# EAGLE design design-v1_1 (EAGLE 7.3.0)

## Sheet 1 of 3: Energy harvester
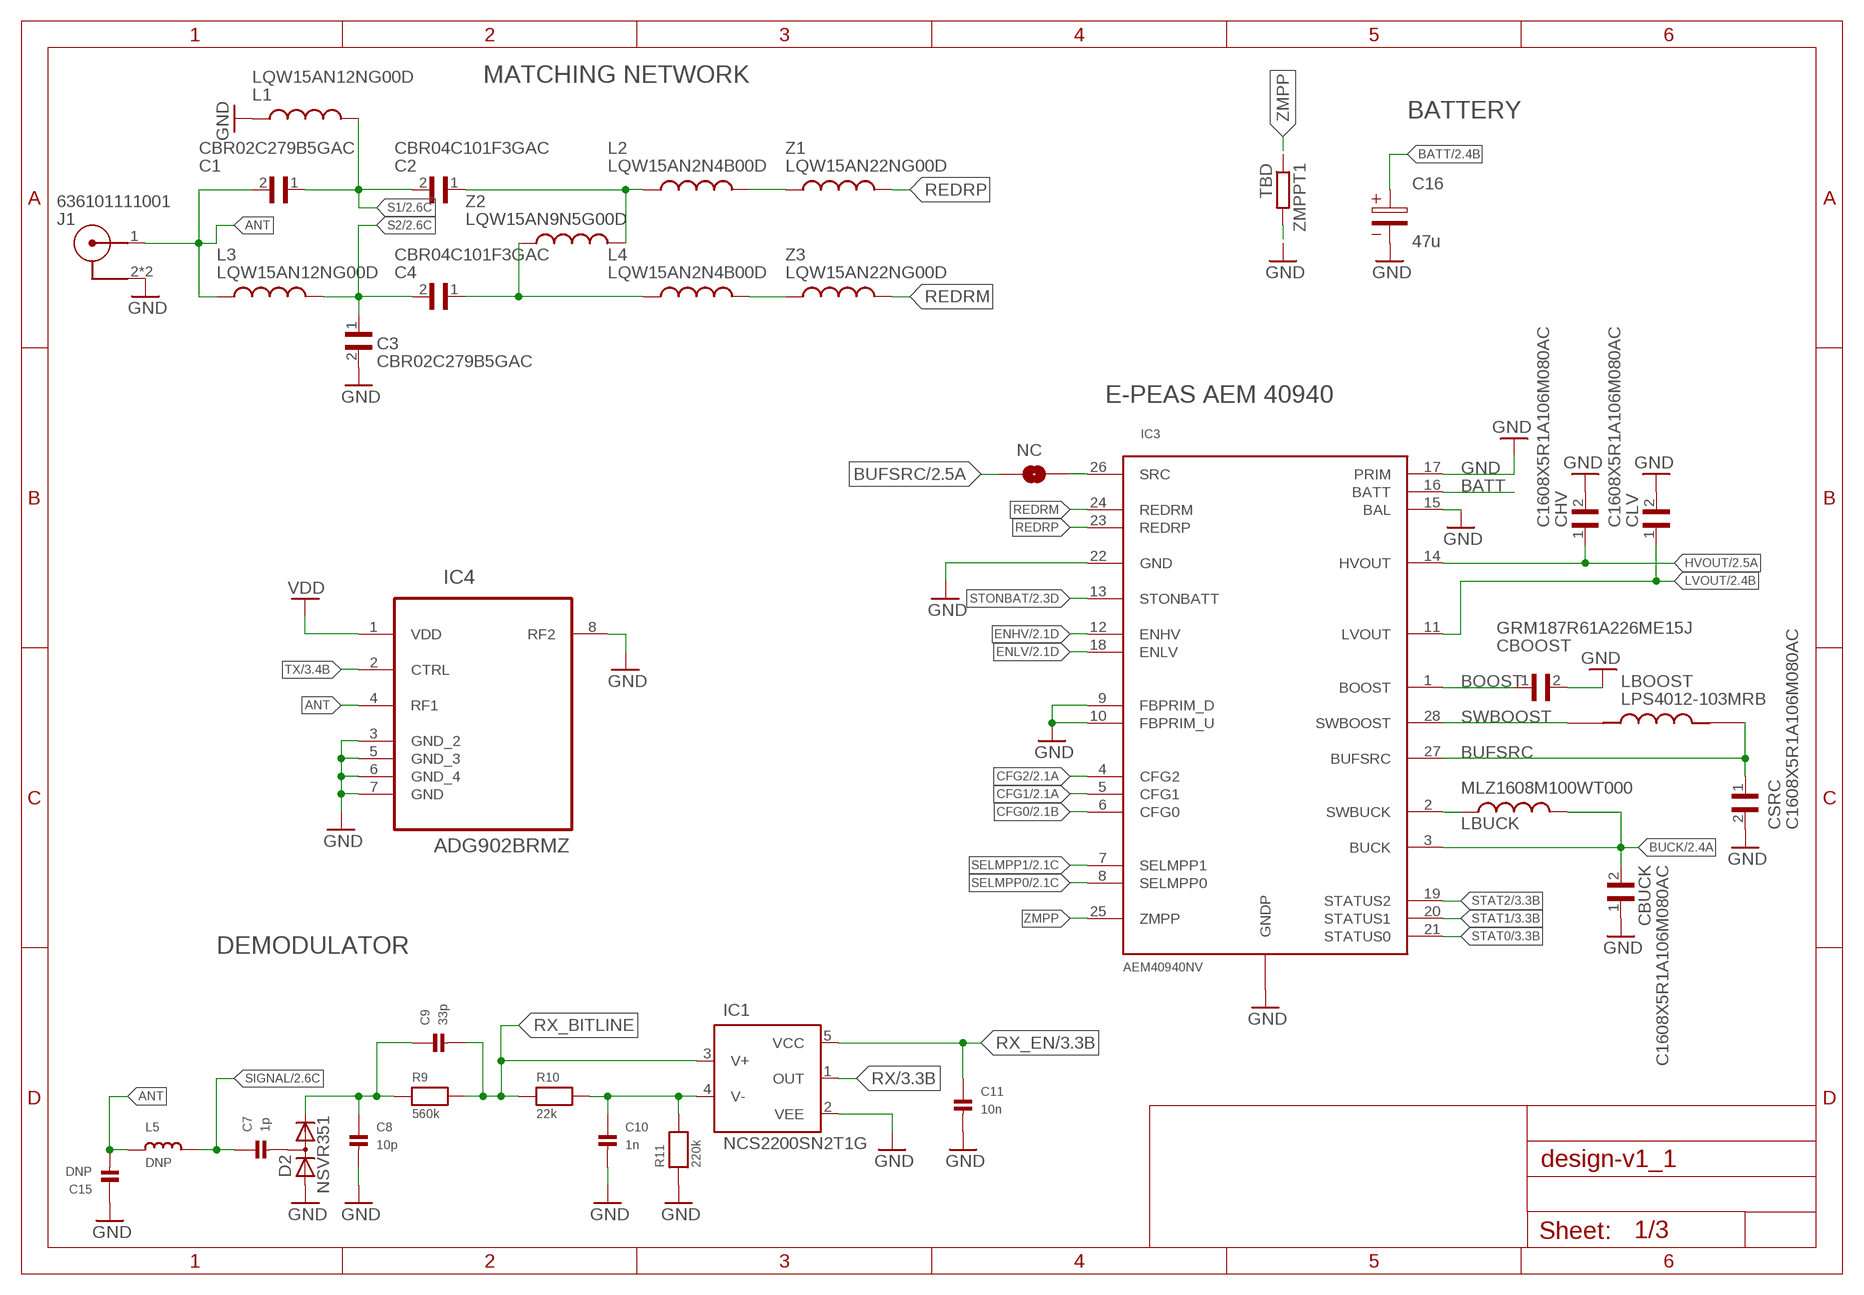
[diagram p0: schematic, sheet 1]

### Parts
C1  CBR02C279B5GAC  CBR04C101F3GAC  [CAPC1005X55N]
C2  CBR04C101F3GAC  [CAPC1005X55N]
C3  CBR02C279B5GAC  CBR04C101F3GAC  [CAPC1005X55N]
C4  CBR04C101F3GAC  [CAPC1005X55N]
C7  1p  CAP_CERAMIC0402  [0402]
C8  10p  CAP_CERAMIC0402  [0402]
C9  33p  CAP_CERAMIC0402  [0402]
C10  1n  CAP_CERAMIC0402  [0402]
C11  10n  CAP_CERAMIC0402  [0402]
C15  DNP  CAP_CERAMIC0402  [0402]
C16  47u  WCAP-ASLI_5X5,5_865080242004  [3X1.6X1.4(BXCXA)]
CBOOST  GRM187R61A226ME15J  [CAPC1608X80N]
CBUCK  C1608X5R1A106M080AC  [CAPC1608X90N]
CHV  C1608X5R1A106M080AC  [CAPC1608X90N]
CLV  C1608X5R1A106M080AC  [CAPC1608X90N]
CSRC  C1608X5R1A106M080AC  [CAPC1608X90N]
D2  NSVR351  DIODE_2CACA-SOT23  [SOT23]
IC1  NCS2200SN2T1G  NCS2200  [SOT95P275X110-5N]
IC3  AEM40940NV  [QFN28_5X5_05P_NO_VIAS]
IC4  ADG902BRMZ  [SOP65P490X110-8N]
J1  636101111001  [636101111001]
L1  LQW15AN12NG00D  [INDC1006X60N]
L2  LQW15AN2N4B00D  [INDC1006X60N]
L3  LQW15AN12NG00D  [INDC1006X60N]
L4  LQW15AN2N4B00D  [INDC1006X60N]
L5  DNP  INDUCTOR_0402  [_0402]
LBOOST  LPS4012-103MRB  [IND_LPS4012-103MRB]
LBUCK  MLZ1608M100WT000  [INDC1608X95N]
NC  JUMPER-SMT_2_NO_SILK  [SMT-JUMPER_2_NO_SILK]
R9  560k  RESISTOR0402  [0402]
R10  22k  RESISTOR0402  [0402]
R11  220k  RESISTOR0402  [0402]
Z1  LQW15AN22NG00D  [INDC1006X60N]
Z2  LQW15AN9N5G00D  [INDC1006X60N]
Z3  LQW15AN22NG00D  [INDC1006X60N]
ZMPPT1  TBD  R-EU_R0805  [R0805]

### Nets
ANT: C1.2 C15.2 IC4.4(RF1) J1.1 L3.1 L5.1
BATT: C16.1 IC3.16(BATT) ; also sheet 2
BOOST: CBOOST.1 IC3.1(BOOST) ; also sheet 2
BUCK: CBUCK.2 IC3.3(BUCK) LBUCK.2 ; also sheet 2
BUFSRC: CSRC.1 IC3.27(BUFSRC) LBOOST.2 NC.2 ; also sheet 2
CFG0: IC3.6(CFG0) ; also sheet 2
CFG1: IC3.5(CFG1) ; also sheet 2
CFG2: IC3.4(CFG2) ; also sheet 2
ENHV: IC3.12(ENHV) ; also sheet 2
ENLV: IC3.18(ENLV) ; also sheet 2
GND: C3.2 C8.2 C10.2 C11.2 C15.1 C16.2 CBOOST.2 CBUCK.1 CHV.2 CLV.2 CSRC.2 D2.1(A) IC1.2(VEE) IC3.9(FBPRIM_D) IC3.10(FBPRIM_U) IC3.15(BAL) IC3.17(PRIM) IC3.22(GND) IC3.GND(GNDP) IC4.3(GND_2) IC4.5(GND_3) IC4.6(GND_4) IC4.7(GND) IC4.8(RF2) J1.2 J1.3 L1.1 R11.1 ZMPPT1.2 ; also sheet 2,3
HVOUT: CHV.1 IC3.14(HVOUT) ; also sheet 2
LVOUT: CLV.1 IC3.11(LVOUT) ; also sheet 2,3
N$3: C2.1 L2.1 Z2.2
N$4: IC3.2(SWBUCK) LBUCK.1
N$5: C4.1 L4.1 Z2.1
N$6: L2.2 Z1.1
N$7: L4.2 Z3.1
N$8: IC3.26(SRC) NC.1
N$15: C10.1 IC1.4(V-) R10.2 R11.2
N$17: C8.1 C9.1 D2.2(C) R9.1
N$18: C7.2 D2.3(AC)
REDRM: IC3.24(REDRM) Z3.2
REDRP: IC3.23(REDRP) Z1.2
RX: IC1.1(OUT) ; also sheet 3
RX_BITLINE: C9.2 IC1.3(V+) R9.2 R10.1
RX_EN: C11.1 IC1.5(VCC) ; also sheet 3
S1: C1.1 C2.2 L1.2 ; also sheet 2
S2: C3.1 C4.2 L3.2 ; also sheet 2
SELMPP0: IC3.8(SELMPP0) ; also sheet 2
SELMPP1: IC3.7(SELMPP1) ; also sheet 2
SIGNAL: C7.1 L5.2 ; also sheet 2
STAT0: IC3.21(STATUS0) ; also sheet 3
STAT1: IC3.20(STATUS1) ; also sheet 3
STAT2: IC3.19(STATUS2) ; also sheet 3
STONBAT: IC3.13(STONBATT) ; also sheet 2
SWBOOST: IC3.28(SWBOOST) LBOOST.1
TX: IC4.2(CTRL) ; also sheet 3
VDD: IC4.1(VDD) ; also sheet 3
ZMPP: IC3.25(ZMPP) ZMPPT1.1

### Notes on the sheet
- MATCHING NETWORK
- BATTERY
- E-PEAS AEM 40940
- DEMODULATOR

## Sheet 2 of 3: Configurations
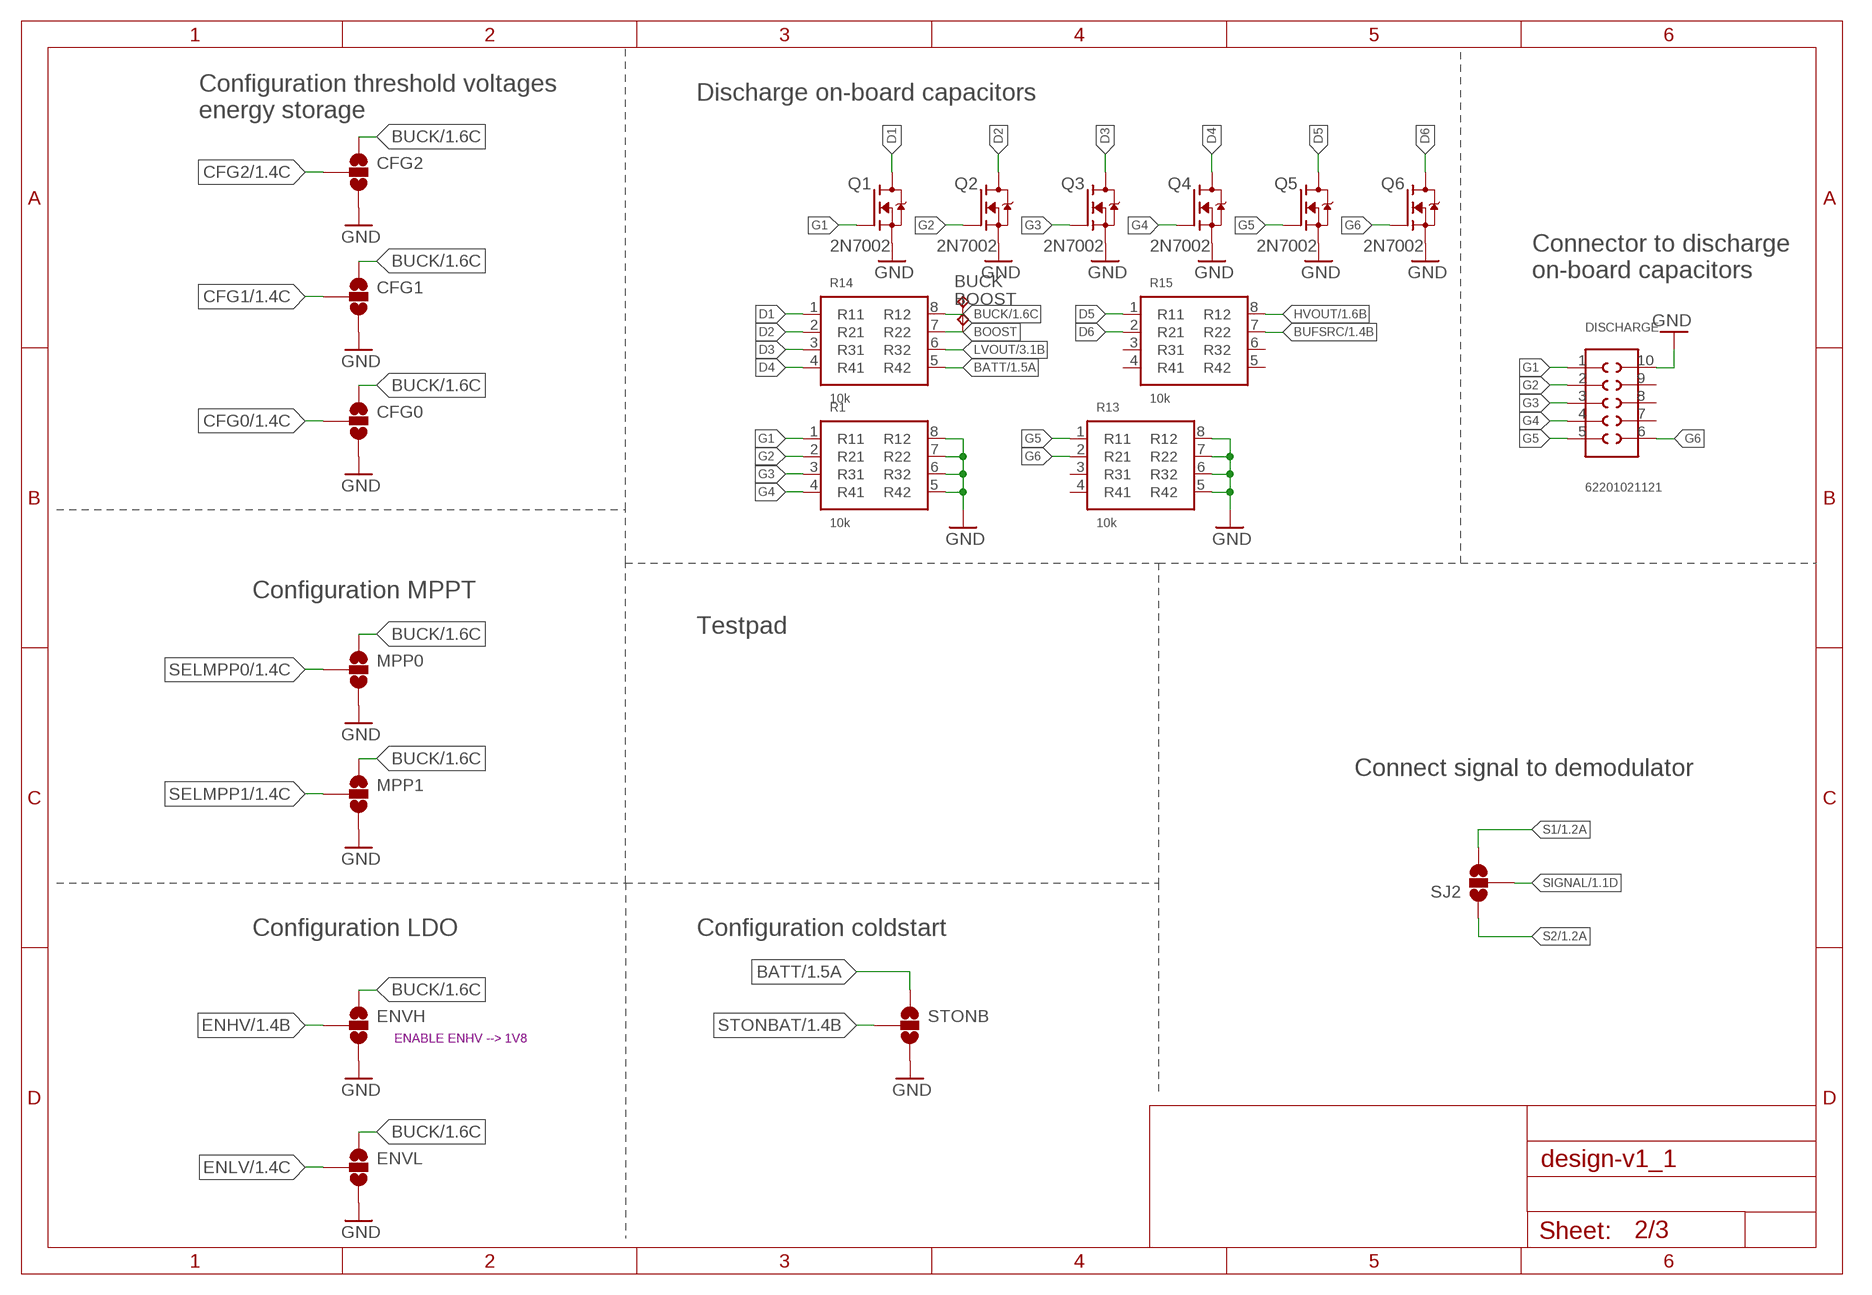
[diagram p1: schematic, sheet 2]

### Parts
BOOST  TPTP06R  [TP06R]
BUCK  TPTP06R  [TP06R]
CFG0  JUMPER-SMT_3_NO_SILK  [SMT-JUMPER_3_NO_SILK]
CFG1  JUMPER-SMT_3_NO_SILK  [SMT-JUMPER_3_NO_SILK]
CFG2  JUMPER-SMT_3_NO_SILK  [SMT-JUMPER_3_NO_SILK]
DISCHARGE  62201021121  [62201021121]
ENVH  JUMPER-SMT_3_NO_SILK  [SMT-JUMPER_3_NO_SILK]
ENVL  JUMPER-SMT_3_NO_SILK  [SMT-JUMPER_3_NO_SILK]
MPP0  JUMPER-SMT_3_NO_SILK  [SMT-JUMPER_3_NO_SILK]
MPP1  JUMPER-SMT_3_NO_SILK  [SMT-JUMPER_3_NO_SILK]
Q1  2N7002  [SOT95P240X111-3N]
Q2  2N7002  [SOT95P240X111-3N]
Q3  2N7002  [SOT95P240X111-3N]
Q4  2N7002  [SOT95P240X111-3N]
Q5  2N7002  [SOT95P240X111-3N]
Q6  2N7002  [SOT95P240X111-3N]
R1  10k  CAY10  [RESCAXS50P200X100X45-8N]
R13  10k  CAY10  [RESCAXS50P200X100X45-8N]
R14  10k  CAY10  [RESCAXS50P200X100X45-8N]
R15  10k  CAY10  [RESCAXS50P200X100X45-8N]
SJ2  SOLDERJUMPER_2WAYS  [SJ_3]
STONB  JUMPER-SMT_3_NO_SILK  [SMT-JUMPER_3_NO_SILK]

### Nets
BATT: R14.5(R42) STONB.1 ; also sheet 1
BOOST: BOOST.TP R14.7(R22) ; also sheet 1
BUCK: BUCK.TP CFG0.1 CFG1.1 CFG2.1 ENVH.1 ENVL.1 MPP0.1 MPP1.1 R14.8(R12) ; also sheet 1
BUFSRC: R15.7(R22) ; also sheet 1
CFG0: CFG0.2 ; also sheet 1
CFG1: CFG1.2 ; also sheet 1
CFG2: CFG2.2 ; also sheet 1
D1: Q1.3(D) R14.1(R11)
D2: Q2.3(D) R14.2(R21)
D3: Q3.3(D) R14.3(R31)
D4: Q4.3(D) R14.4(R41)
D5: Q5.3(D) R15.1(R11)
D6: Q6.3(D) R15.2(R21)
ENHV: ENVH.2 ; also sheet 1
ENLV: ENVL.2 ; also sheet 1
G1: DISCHARGE.1 Q1.1(G) R1.1(R11)
G2: DISCHARGE.2 Q2.1(G) R1.2(R21)
G3: DISCHARGE.3 Q3.1(G) R1.3(R31)
G4: DISCHARGE.4 Q4.1(G) R1.4(R41)
G5: DISCHARGE.5 Q5.1(G) R13.1(R11)
G6: DISCHARGE.6 Q6.1(G) R13.2(R21)
GND: CFG0.3 CFG1.3 CFG2.3 DISCHARGE.10 ENVH.3 ENVL.3 MPP0.3 MPP1.3 Q1.2(S) Q2.2(S) Q3.2(S) Q4.2(S) Q5.2(S) Q6.2(S) R1.5(R42) R1.6(R32) R1.7(R22) R1.8(R12) R13.5(R42) R13.6(R32) R13.7(R22) R13.8(R12) STONB.3 ; also sheet 1,3
HVOUT: R15.8(R12) ; also sheet 1
LVOUT: R14.6(R32) ; also sheet 1,3
S1: SJ2.3 ; also sheet 1
S2: SJ2.1 ; also sheet 1
SELMPP0: MPP0.2 ; also sheet 1
SELMPP1: MPP1.2 ; also sheet 1
SIGNAL: SJ2.2 ; also sheet 1
STONBAT: STONB.2 ; also sheet 1
Unconnected: DISCHARGE.7 DISCHARGE.8 DISCHARGE.9 R13.3(R31) R13.4(R41) R15.3(R31) R15.4(R41) R15.5(R42) R15.6(R32)

### Notes on the sheet
- Discharge on-board capacitors
- Configuration threshold voltages 
  energy storage
- Connector to discharge 
  on-board capacitors
- Configuration MPPT
- Testpad
- Connect signal to demodulator
- Configuration LDO | Configuration coldstart
- ENABLE ENHV --> 1V8

## Sheet 3 of 3: MCU
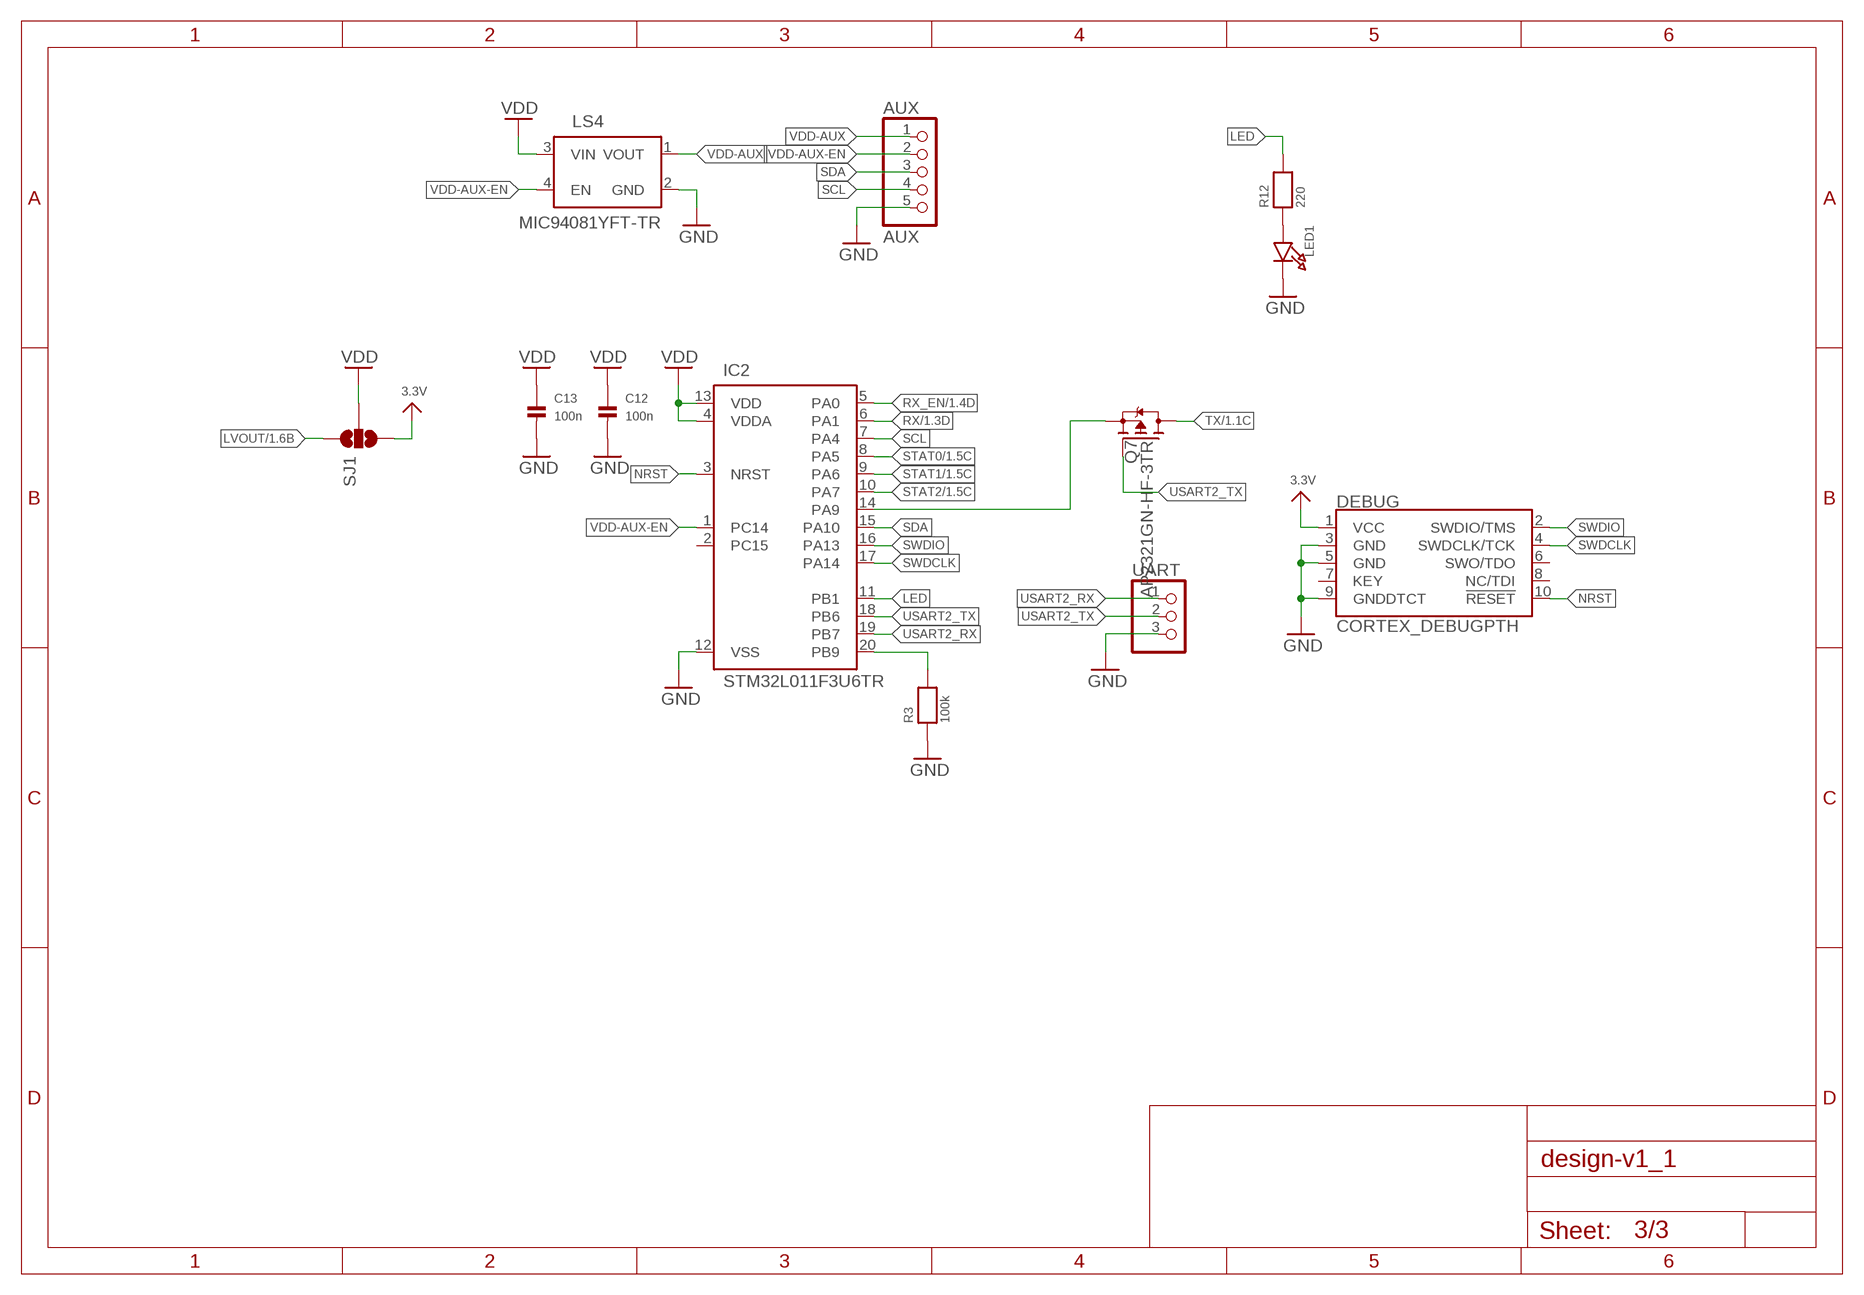
[diagram p2: schematic, sheet 3]

### Parts
AUX  AUX  HEADER-1X5ROUND  [1X05_ROUND]
C12  100n  CAP_CERAMIC0402  [0402]
C13  100n  CAP_CERAMIC0402  [0402]
DEBUG  CORTEX_DEBUGPTH  [2X5-PTH-1.27MM]
IC2  STM32L011F3U6TR  [QFN50P300X300X60-21N]
LED1  LED0805  [CHIPLED_0805]
LS4  MIC94081YFT-TR  [IC_MIC94081YFT-TR]
Q7  AP2321GN-HF-3TR  [SOT23-3]
R3  100k  RESISTOR0402  [0402]
R12  220  RESISTOR0603  [0603]
SJ1  SOLDERJUMPER_2WAYS  [SJ_3]
UART  HEADER-1X3ROUND  [1X03_ROUND]

### Nets
3.3V: DEBUG.1(VCC) SJ1.3
GND: AUX.5 C12.2 C13.2 DEBUG.3(GND) DEBUG.5(GND) DEBUG.9(GNDDTCT) IC2.12(VSS) LED1.C LS4.2(GND) R3.1 UART.3 ; also sheet 1,2
LED: IC2.11(PB1) R12.2
LVOUT: SJ1.1 ; also sheet 1,2
N$1: IC2.14(PA9) Q7.2(S)
N$20: LED1.A R12.1
NRST: DEBUG.10(!RESET) IC2.3(NRST)
PB9: IC2.20(PB9) R3.2
RX: IC2.6(PA1) ; also sheet 1
RX_EN: IC2.5(PA0) ; also sheet 1
SCL: AUX.4 IC2.7(PA4)
SDA: AUX.3 IC2.15(PA10)
STAT0: IC2.8(PA5) ; also sheet 1
STAT1: IC2.9(PA6) ; also sheet 1
STAT2: IC2.10(PA7) ; also sheet 1
SWDCLK: DEBUG.4(SWDCLK/TCK) IC2.17(PA14)
SWDIO: DEBUG.2(SWDIO/TMS) IC2.16(PA13)
TX: Q7.3(D) ; also sheet 1
USART2_RX: IC2.19(PB7) UART.1
USART2_TX: IC2.18(PB6) Q7.1(G) UART.2
VDD: C12.1 C13.1 IC2.4(VDDA) IC2.13(VDD) LS4.3(VIN) SJ1.2 ; also sheet 1
VDD-AUX: AUX.1 LS4.1(VOUT)
VDD-AUX-EN: AUX.2 IC2.1(PC14) LS4.4(EN)
Unconnected: DEBUG.6(SWO/TDO) DEBUG.7(KEY) DEBUG.8(NC/TDI) IC2.2(PC15)

## Library data of the parts
AUX = microbuilder:HEADER-1X5: PIN HEADER
BOOST BUCK = testpad:TP: Test pad
C1-C4 = CBR04C101F3GAC:CBR04C101F3GAC: Cap Ceramic 100pF 25V C0G 1% Pad SMD 0402 125C Medical T/R Check prices <https://pricing.snapeda.com/parts/CBR04C101F3GAC/KEMET/view-part?ref=eda>; AVAILABILITY: In Stock; DESCRIPTION: 100pF ±1% 25V Ceramic Capacitor C0G, NP0 0402 (1005 Metric); MF: KEMET; MP: CBR04C101F3GAC; PACKAGE: 0402 KEMET; PRICE: None; PURCHASE-URL: https://pricing.snapeda.com/search/part/CBR04C101F3GAC/?ref=eda
C7-C13 C15 = microbuilder:CAP_CERAMIC: Ceramic Capacitors 0402 - 0402 Surface Mount Capacitors 16pF 50V 5% [Digikey: 445-4899-2-ND] 18pF 50V 5% [Digikey: 490-1281-2-ND] 22pF 50V 5% [Digikey: 490-1283-2-ND] 68pF 50V 5% [Digikey: 490-1289-2-ND] 0.1uF 10V 10% [Digikey: 490-1318-2-ND] 1.0uF 6.3V 10% [Digikey: 490-1320-2-ND] 0603 - 0603 Surface Mount Capacitors 16 pF 50V 5% [Digikey: 445-5051-2-ND] 22 pF 50V [Digikey: PCC220ACVTR-ND] 33 pF 50V 5% [Digikey: 490-1415-1-ND] 56pF 50V 5% [Digikey: 490-1421-1-ND] 220pF 50V 5% [Digikey: 445-1285-1-ND] 680 pF 50V 2200 pF 50V 5% C0G [Digikey: 445-1297-1-ND] 5600 pF 100V 5% X7R [Digikey: 478-3711-1-ND] 0.1 µF 25V 10% [Digikey: PCC2277TR-ND] 0.22 µF 16V 10% X7R [Digikey: 445-1318-1-ND] 1.0 µF 25V 10% [Digikey: 445-5146-2-ND] 0603 - RF Specific 3pF 250V +/-0.1pF RF [Digikey: 712-1347-1-ND] 18 pF 250V 5% [Digikey: 478-3505-1-ND or 712-1322-1-ND] 56 pF 250V 5% C0G RF [Digikey: 490-4867-1-ND] 68 pF 250V RF [Digikey: 490-4868-1-ND] 0805 - 0805 Surface Mount Capacitors 220 pF 250V 2% RF Ceramic Capacitor [Digikey: 712-1398-1-ND] 1000 pF 50V 2% NP0 Ceramic Capacitor [Digikey: 478-3760-1-ND] 0.1 µF 25V 10% Ceramic Capacitor [Digikey: PCC1828TR-ND] 1.0 µF 16V 10% Ceramic Capacitor[Digikey: 490-1691-2-ND] 10.0 µF 10V 10% Ceramic Capacitor[Digikey: 709-1228-1-ND] 10.0 uF 16V 10% Ceramic Capacitor [Digikey: 478-5165-2-ND] 47 uF 6.3V 20% Ceramic Capacitor [Digikey: 587-1779-1-ND or 399-5506-1-ND] 1206 - 1206 Surface Mount Capacitors 47uF 10V 20% Ceramic Capacitor [Digikey: 490-5528-1-ND or 399-5508-1-ND or 445-6010-1-ND] 100uF 6.3V -20%, +80% Y5V Ceramic Capacitor (Digikey: 490-4512-1-ND, Mouser: 81-GRM31CF50J107ZE1L)
C16 = Kondensatoren (rev17a):WCAP-ASLI: WCAP-ASLI Aluminum Electrolytic Capacitors Characteristics Aluminum Electrolytic Capacitor Recommended soldering: Reflow Operating temperature: -55 °C to +105 °C Low impedance product series Load life:2000 h @ +105 °C Package name and Variant abbreviation: Package: Package: B X C X A = length of the solder pad X width of the solder pad X pitch of the solder pad. <http://katalog.we-online.de/media/images/eisos/WCAP-ASLI_pf2.jpg> Details see: http://katalog.we-online.de/en/pbs/WCAP-ASLI Updated by: Yingchun,Shan Updated: 2017-03-16 2017 (C) Wurth Elektronik; WE-NUMBER: 865080242004/47uF
CBOOST = GRM187R61A226ME15J:GRM187R61A226ME15J: CAP CER MLCC Check prices <https://pricing.snapeda.com/parts/GRM187R61A226ME15J/Murata%20Electronics/view-part?ref=eda>; AVAILABILITY: In Stock; DESCRIPTION: SMD capacitor X5R(EIA) with capacitance 22uF Tol.20%. Rated voltage 10Vdc 85C; MF: Murata Electronics; MP: GRM187R61A226ME15J; PACKAGE: 1608 Murata; PRICE: None; PURCHASE-URL: https://pricing.snapeda.com/search/part/GRM187R61A226ME15J/?ref=eda
CBUCK CHV CLV CSRC = C1608X5R1A106M080AC:C1608X5R1A106M080AC: Capacitor MLCC 0603 10V 10uF X5R Check prices <https://pricing.snapeda.com/parts/C1608X5R1A106M080AC/TDK/view-part?ref=eda>; AVAILABILITY: In Stock; DESCRIPTION: 10µF ±20% 10V Ceramic Capacitor X5R 0603 (1608 Metric); MF: TDK; MP: C1608X5R1A106M080AC; PACKAGE: 1608 TDK; PRICE: None; PURCHASE-URL: https://pricing.snapeda.com/search/part/C1608X5R1A106M080AC/?ref=eda
CFG0 CFG1 CFG2 ENVH ENVL MPP0 MPP1 STONB = SparkFun-Jumpers:JUMPER-SMT_3_NO: Normally open jumper This jumper has three pads in close proximity to each other. Apply solder to close the connection(s).
D2 = diode:DIODE_2CACA-: 2 Diodes - Cathode-Anode|Cathode-Anode
DEBUG = SparkFun-Connectors:CORTEX_DEBUG: Cortex Debug Connector Datasheet <http://infocenter.arm.com/help/topic/com.arm.doc.faqs/attached/13634/cortex_debug_connectors.pdf>
DISCHARGE = Wurth_Elektronik_Electromechanic_Board_to_Board_Connectors_rev15c:62201021121: WR-PHD 1.27mm Dual Pin Header, 10 Pins=>Code : Con_BTB_PHD_1.27_2_62201021121 <http://katalog.we-online.de/media/thumbs2/eican/thb_Con_BTB_PHD_1.27_2_6220xx21121_pf2.jpg> Details see: http://katalog.we-online.de/en/em/622_0xx_211_21 Created 2014-06-03, Karrer Zheng 2014 (C) Würth Elektronik
IC1 = NCS2200SN2T1G:NCS2200
IC2 = STM32L011F3U6TR:STM32L011F3U6TR: UFQFPN20; A_MAX: 0.6; B_MAX: 0.3; B_MIN: 0.18; B_NOM: 0.25; D2_NOM: 1.5; D_MAX: 3.1; D_MIN: 2.9; D_NOM: 3.0; E2_NOM: 1.5; ENOM: 0.5; E_MAX: 3.1; E_MIN: 2.9; E_NOM: 3.0; L_MAX: 0.23; L_MIN: 0.13; L_NOM: 0.35; MANUFACTURER: STMicroelectronics; PIN_COUNT_D: 5.0; PIN_COUNT_E: 5.0; SNAPEDA_PACKAGE_ID: 23449; STANDARD: IPC 7351B
IC3 = AEM40940:AEM40940: AEM40940 – Energy Harvesting Power Management IC Check prices <https://pricing.snapeda.com/parts/AEM40940/Sensata/view-part?ref=eda>; AVAILABILITY: In Stock; DESCRIPTION: Power Management Specialized - PMIC AEM40940 IC - RF with Input Power Limited Energy Harvesting Manager; MF: Sensata; MP: AEM40940; PACKAGE: None; PRICE: None; PURCHASE-URL: https://pricing.snapeda.com/search/part/AEM40940/?ref=eda
IC4 = ADG902BRMZ:ADG902BRMZ: 1.65 V to 2.75 V, SPST Switches Check availability <https://pricing.snapeda.com/parts/ADG902BRMZ/Analog%20Devices/view-part?ref=eda>; AVAILABILITY: In Stock; DESCRIPTION: RF Switch IC General Purpose SPST 2.5 GHz 50Ohm 8-MSOP; MF: Analog Devices; MP: ADG902BRMZ; PACKAGE: MSOP-8 Analog Devices; PRICE: None; PURCHASE-URL: https://pricing.snapeda.com/search/part/ADG902BRMZ/?ref=eda
J1 = Eagle_WR-UMRF (rev21b):636101111001: WR-UMRF PCB Receptacle SMT with 3 Pads MATERIAL PROPERTIES Insulator Material LCP Insulator Color Natural Insulator Flammability Rating UL94 V-0 Center Contact Material Brass Center Contact Plating Gold over Nickel GENERAL INFORMATION Operating Temperature -40 up to +90 °C <https://www.we-online.com/katalog/media/o325314v209%20Single_WR-UMRF_63610111x001.jpg> Details see: https://www.we-online.com/katalog/en/PCB_RECECTACLE_SMT_WITH_3_PADS Updated by Ella Wu 2021-07-20 2021(C) Würth Elektronik; DATASHEET-URL: https://www.we-online.com/catalog/datasheet/636101111001.pdf; GENDER: PCB Receptacle; MOUNT: SMT; PART-NUMBER: 636101111001; Z: 50Ohm
L1 L3 = LQW15AN12NG00D:LQW15AN12NG00D: LQW15 Series 0402 12 nH ±2 % 500 mA 0.14 Ohm SMT Unshielded Wirewound Inductor Check prices <https://pricing.snapeda.com/parts/LQW15AN12NG00D/Murata/view-part?ref=eda>; AVAILABILITY: In Stock; DESCRIPTION: Inductor with Inductance: 12nH Tol. +/-2%, Package: 0402 (1005); MF: Murata; MP: LQW15AN12NG00D; PACKAGE: 1006 Murata; PRICE: None; PURCHASE-URL: https://pricing.snapeda.com/search/part/LQW15AN12NG00D/?ref=eda
L2 L4 = LQW15AN2N4B00D:LQW15AN2N4B00D: Inductor RF SMD 0402 wirewound 2.4nH Check prices <https://pricing.snapeda.com/parts/LQW15AN2N4B00D/Murata/view-part?ref=eda>; AVAILABILITY: In Stock; DESCRIPTION: Inductor with Inductance: 2.4nH Tol. +/-0.1nH, Package: 0402 (1005); MF: Murata; MP: LQW15AN2N4B00D; PACKAGE: 1006 Murata; PRICE: None; PURCHASE-URL: https://pricing.snapeda.com/search/part/LQW15AN2N4B00D/?ref=eda
L5 = microbuilder:INDUCTOR: Inductors 0603: 10nH Ceramic Inductor - microwire antenna/RF (Digikey: 712-1434-2-ND) 0805: 560nH Ceramic Inductor - RF (Digikey: 553-1047-1-ND) 270nH Ceramic Inductor - Q = 40@250MHz, +-5%, 1 Ohm DC Resistance (Digikey: 535-10506-2-ND) 1007 (2518 Metric) SMT: 10µH 10% 250mOhm 820mA 1007 Inductor (Digikey: 587-2189-1-ND) 22µH 10% 500mOhm 580mA 1007 Inductor (Digikey: 587-2190-1-ND) 47µH 10% 950mOhm 420mA 1007 Inductor (Digikey: 587-2191-1-ND) 47µH 5% 100mOhm 1A 1008 Inductor (Digikey: 732-1816-1-ND) 5.0x5.0mm (Taiyo Yuden NR5040 Series) 6.8µH 20% 2.3A 64mOhm Inductor (Digikey: 587-2374-2-ND) 5.0x5.0mm (TDK VLC5045 Series) 4.7µH 20% 3.3A 34mOhm Inductor (Digikey: 445-6526-1-ND) 6.8µH 20% 2.7A 46mOhm Inductor (Digikey: 445-6527-1-ND) 6.0x6.0mm (TDK VLC6045 Series) 4.7µH 20% 3.8A 27mOhm Inductor (Digikey: 445-6538-2-ND) 6.8µH 20% 3A 41mOhm Inductor (Digikey: 445-6540-1-ND) 6.2µH 30% 2.2A 45mOhm Inductor (Digikey: SRR5028-6R2YCT-ND) - Not TDK VLC6045 but footprint should match 6.0x6.0mm (TDK SLF6045 Series) 6.8uH 30% 2A 33mOhm Inductor (Digikey: 445-4572-1-ND, Mouser: 810-SLF645T6R8N2R0PF)
LBOOST = LPS4012-103MRB:LPS4012-103MRB: Power inductor, shielded, 20/30% tol, SMT, RoHS, lead-free, halogen-free Check prices <https://pricing.snapeda.com/parts/LPS4012-103MRB/Coilcraft/view-part?ref=eda>; AVAILABILITY: In Stock; DESCRIPTION: Power inductor, shielded, 20/30% tol, SMT, RoHS, lead-free, halogen-free; MF: Coilcraft; MP: LPS4012-103MRB; PACKAGE: None; PRICE: None; PURCHASE-URL: https://pricing.snapeda.com/search/part/LPS4012-103MRB/?ref=eda
LBUCK = MLZ1608M100WT000:MLZ1608M100WT000
LED1 = microbuilder:LED: LED 0603 - 0603 Surface Mount Package 2mA: Green LED - Low Power (3.9mcd, 2ma, 1.7Vf) - Digikey: 475-2709-2-ND Orange LED - Low Power (9.8mcd, 2ma, 1.8Vf) - Digikey: 475-1194-2-ND Red LED - Low Power (5mcd, 2ma, 1.8Vf) - Digikey: 475-1195-2-ND Yellow LED - Low Power (7mcd, 2ma, 1.8Vf) - Digikey: 475-1196-2-ND 5mA: Blue LED - Low Power (17mcd, 5ma, 2.9Vf) - Digikey: LNJ937W8CRACT-ND 0805 - 0805 Surface Mount Package 2mA: Red LED (8.8mcd, 2mA, 1.8Vf, Clear) - Low Power [Digikey: 475-2510-1-ND] Green LED (5mcd, 2mA, 1.8Vf, Clear) - Low Power [Digikey: 475-2730-1-ND] Yellow LED (11.3mcd, 2mA, 1.8Vf, Clear) - Low Power [Digikey: 475-2555-1-ND] 20mA: Red LED (104mcd, 20mA, Diffused) - LS R976 [Digikey: 475-1278-6-ND] Red LED (12mcd, 20mA, 2.0Vf, Clear) - APT2012EC [Digikey: 754-1128-1-ND] Green LED (15mcd, 20mA, 2.2Vf, Clear) - APT2012GC [Digikey: 754-1131-1-ND] Orange LED (160mcd, 20mA, 2.1Vf, Clear) - APT2012SECK [Digikey: 754-1130-1-ND] 1206 - 1206 Surface Mount Package Green LED (26mcd, 20mA, Diffused) - LG N971 [Digikey: 475-1407-6-ND] Red LED (15mcd, 20mA, Diffused) - LH N974 [Digikey: 475-1416-6-ND]
LS4 = MIC94081YFT-TR:MIC94081YFT-TR: Power Switch/Driver 1:1 P-Channel 2A 4-TMLF® (0.85x0.85) Check prices <https://pricing.snapeda.com/parts/MIC94081YFT-TR/Microchip/view-part?ref=eda>; AVAILABILITY: In Stock; DESCRIPTION: Power Switch/Driver 1:1 P-Channel 2A 4-TMLF® (0.85x0.85); MF: Microchip; MP: MIC94081YFT-TR; PACKAGE: UFDFN-4 Microchip; PRICE: None
NC = SparkFun-Jumpers:JUMPER-SMT_2_NO: Normally open jumper This jumper has two pads in close proximity to each other. Apply solder to close the connection. Round pads are easier to solder for beginners, but are a lot larger. SparkFun Product that uses the round pads: SparkFun EL Sequencer <https://www.sparkfun.com/products/12781>
Q1-Q6 = 2N7002:2N7002: N-Channel 60V 280mA (Ta) 350mW (Ta) Surface Mount SOT-23-3 (TO-236) Check prices <https://pricing.snapeda.com/parts/2N7002/ON%20Semiconductor/view-part?ref=eda>; AVAILABILITY: In Stock; DESCRIPTION: Mosfet Array 2 N-Channel (Dual) 60V 300mA 500mW Surface Mount PG-SOT363-6; MF: ON Semiconductor; MP: 2N7002; PACKAGE: SOT-23 Multicomp; PRICE: None; PURCHASE-URL: https://pricing.snapeda.com/search/part/2N7002/?ref=eda
Q7 = AP2321GN-HF-3TR:AP2321GN-HF-3TR: P-Kanal Mosfet - Vds=40V - Vgs=+-20V - Imax=3.1A Check availability <https://pricing.snapeda.com/parts/AP2321GN-HF-3TR/Advanced%20Power%20Electronics/view-part?ref=eda>; AVAILABILITY: Not in stock; DESCRIPTION: MOSFET Transistor, P Channel, -3.1 A, -40 V, 0.09 ohm, -10 V, -1 V; MF: Advanced Power Electronics; MP: AP2321GN-HF-3TR; PACKAGE: SOT-23 Advanced Power Electronics; PRICE: None
R1 R13-R15 = Res-Matrix:CAY10
R3 R9-R12 = microbuilder:RESISTOR: Resistors 0402 - 0402 Surface Mount Package 22 Ohm 1% 1/16W [Digikey: 311-22.0LRTR-ND] 33 Ohm 5% 1/16W 1.0K 5% 1/16W 1.5K 5% 1/16W 2.0K 1% 1/16W 10.0K 1% 1/16W [Digikey: 311-10.0KLRTR-ND] 10.0K 5% 1/16W [Digikey: RMCF0402JT10K0TR-ND] 12.1K 1% 1/16W [Digikey: 311-22.0LRTR-ND] 100.0K 5% 1/16W 0603 - 0603 Surface Mount Package 0 Ohm 1/10 Watt 1% Resistor 15 Ohm 1/10 Watt 1% Resistor 33 Ohm 1/10 Watt 1% Resistor 49.9 Ohm 1/10 Watt 1% Resistor 100 Ohm 1/10 Watt 1% Resistor 150 Ohm 1/10 Watt 1% Resistor 240 Ohm 1/10 Watt 1% Resistor 390 Ohm 1/10 Watt 1% Resistor 560 Ohm 1/10 Watt 1% Resistor 680 Ohm 1/10 Watt 1% Resistor 750 Ohm 1/10 Watt 1% Resistor 1.0K Ohm 1/10 Watt 1% Resistor 1.5K Ohm 1/10 Watt 1% Resistor 2.0K Ohm 1/10 Watt 1% Resistor 2.2K Ohm 1/10 Watt 1% Resistor 3.3K Ohm 1/10 Watt 1% Resistor 4.7K Ohm 1/10 Watt 1% Resistor 10.0K Ohm 1/10 Watt 1% Resistor 12.0K Ohm 1/10 Watt 1% Resistor 12.1K Ohm 1/10 Watt 1% Resistor 20.0K Ohm 1/10 Watt 1% Resistor 33.0K Ohm 1/10 Watt 1% Resistor 100.0K Ohm 1/10 Watt 1% Resistor 0805 - 0805 Surface Mount Package 0 Ohm 1/8 Watt 1% Resistor 33 Ohm 1/8 Watt 1% Resistor 100 Ohm 1/8 Watt 1% Resistor 150 Ohm 1/8 Watt 1% Resistor 200 Ohm 1/8 Watt 1% Resistor 240 Ohm 1/8 Watt 1% Resistor 330 Ohm 1/8 Watt 1% Resistor 390 Ohm 1/8 Watt 1% Resistor 470 Ohm 1/8 Watt 1% Resistor 1.0K Ohm 1/8 Watt 1% Resistor 1.5K Ohm 1/8 Watt 1% Resistor 2.0K Ohm 1/8 Watt 1% Resistor 4.7K Ohm 1/8 Watt 1% Resistor 5.1K Ohm 1/8 Watt 1% Resistor 5.6K Ohm 1/8 Watt 1% Resistor 10.0K Ohm 1/8 Watt 1% Resistor 22.0K Ohm 1/8 Watt 1% Resistor 33.0K Ohm 1/8 Watt 1% Resistor 100K Ohm 1/8 Watt 1% Resistor 1206 - 1206 Surface Mount Package 2012 - 2010 Surface Mount Package 0.11 Ohm 1/2 Watt 1% Resistor - Digikey: RHM.11UCT-ND
SJ1 SJ2 = SparkFun-Retired:SOLDERJUMPER_2WAY: Solder Jumper 2 way solder jumper
UART = microbuilder:HEADER-1X3: PIN HEADER
Z1 Z3 = LQW15AN22NG00D:LQW15AN22NG00D: INDUCTOR, 0402, 22NH; Inductance:22nH; Inductance Tolerance:± 2%; DC Resistance Max:0.3ohm; DC Current Rating:310mA; Core Material:Alumina; Inductor Case Style:0402; No. of Pins:2; External Depth:0.6mm; External Length / Height:0.5mm; External Width:1mm; Inductor Type:Chip Coils; Operating Temperature Max:125°C; Operating Temperature Min:-55°C; Q Factor @ Frequency:25 @ 250MHz; Resistance:0.3ohm; Resonant Frequency:4GHz; Series:LQW15; Test Frequency:100MHz Check prices <https://pricing.snapeda.com/parts/LQW15AN22NG00D/Murata/view-part?ref=eda>; AVAILABILITY: In Stock; DESCRIPTION: Inductor with Inductance: 22nH Tol. +/-2%, Package: 0402 (1005); MF: Murata; MP: LQW15AN22NG00D; PACKAGE: 1006 Murata; PRICE: None; PURCHASE-URL: https://pricing.snapeda.com/search/part/LQW15AN22NG00D/?ref=eda
Z2 = LQW15AN9N5G00D:LQW15AN9N5G00D: LQW15 Series 0402 9.5 nH ±2 % 540 mA 0.14 Ohm SMT Unshielded Wirewound Inductor Check prices <https://pricing.snapeda.com/parts/LQW15AN9N5G00D/Murata/view-part?ref=eda>; AVAILABILITY: In Stock; DESCRIPTION: Inductor with Inductance: 9.5nH Tol. +/-2%, Package: 0402 (1005); MF: Murata; MP: LQW15AN9N5G00D; PACKAGE: 1006 Murata; PRICE: None; PURCHASE-URL: https://pricing.snapeda.com/search/part/LQW15AN9N5G00D/?ref=eda
ZMPPT1 = rcl:R-EU_: RESISTOR, European symbol; SPICEPREFIX: R

## Board
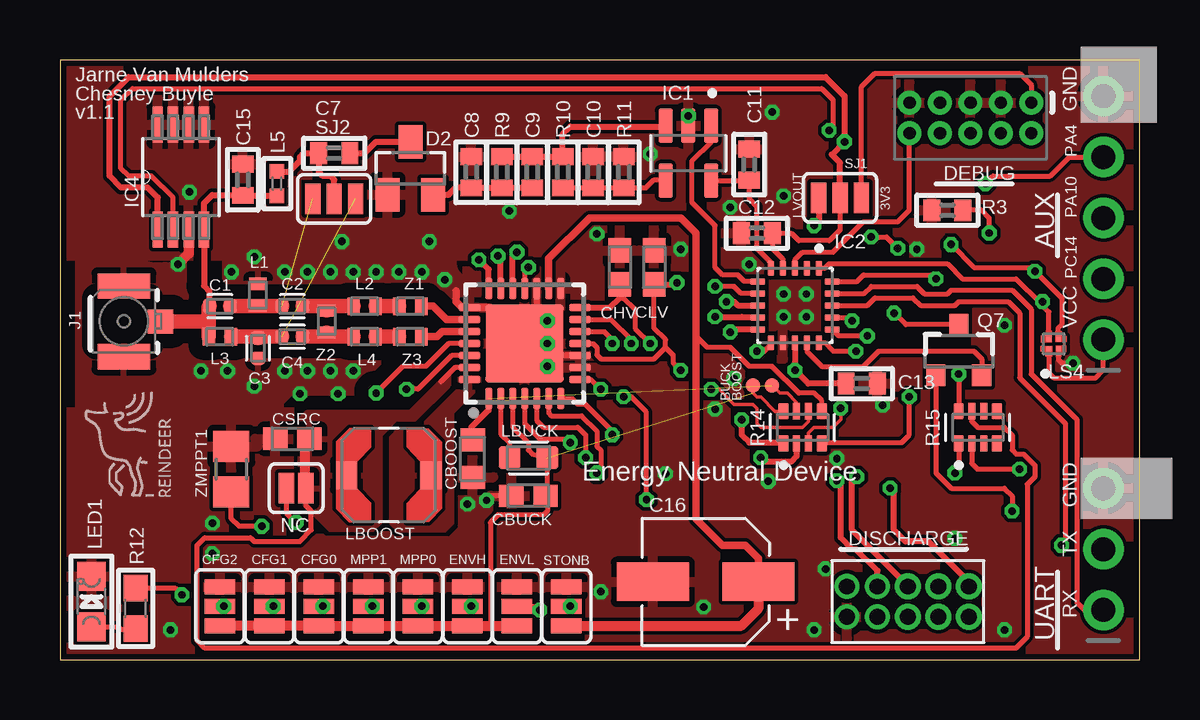
[diagram p3: board, top side]
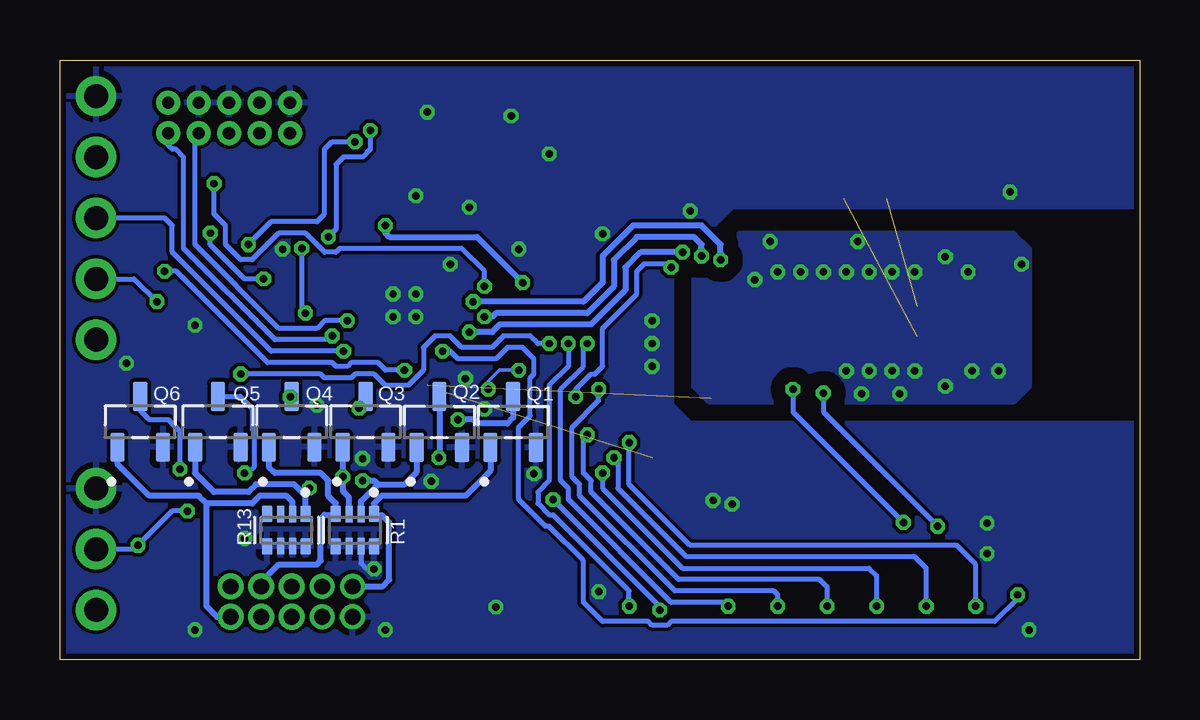
[diagram p4: board, bottom side, seen from below]

Size 45 x 25 mm. Coordinates in mm from the lower left corner, seen from the top.
Outline: 0,0 45,0 45,25 0,25 0,0
Copper layers (1*16): Top 0.035mm / dielectric 1.5mm / Bottom 0.035mm
Design rules "SeeedStudio_2layer_DRU_no_angle_20140221 *": minimum track width 6mil, minimum drill 12mil, track to track 6mil, track to pad 6mil, pad to pad 6mil, via to via 6mil, smd to smd 0mil, copper to edge 10mil, drill to drill 10mil, minimum pad ring 8mil, minimum via ring 6mil, stop-mask expansion 2mil, vias tented up to drill 100mil, thermal gap 10mil

### Footprints (pad centres in the part's own frame; a part is rotated, then mirrored left to right if it is on the bottom)
1X05_ROUND = drill 1 pad 1.676: 1 -5.08,0; 2 -2.54,0; 3 0,0; 4 2.54,0; 5 5.08,0
TP06R = smd 0.6 x 0.6: TP 0,0
CAPC1005X55N = smd 0.54 x 0.6: 1 -0.43,0; 2 0.43,0
0402 = smd 0.7 x 0.9: 1 -0.65,0; 2 0.65,0
3X1.6X1.4(BXCXA) = smd 3 x 1.6: 1 2.2,0; 2 -2.2,0
CAPC1608X80N = smd 0.96 x 1.02: 1 -0.778,0; 2 0.778,0
CAPC1608X90N = smd 1.01 x 0.93: 1 -0.709,0; 2 0.709,0
SMT-JUMPER_3_NO_SILK = smd 0.635 x 1.27: 1 -0.813,0; 2 0,0; 3 0.813,0
SOT23 = smd 1 x 1.4: 1 -0.95,-1.1; 2 0.95,-1.1; 3 0,1.1
2X5-PTH-1.27MM = drill 0.508 pad 1: 1 -2.54,-0.635; 2 -2.54,0.635; 3 -1.27,-0.635; 4 -1.27,0.635; 5 0,-0.635; 6 0,0.635; 7 1.27,-0.635; 8 1.27,0.635; 9 2.54,-0.635; 10 2.54,0.635
62201021121 = drill 0.65 pad 0.965: 1 -2.54,0.635; 2 -1.27,0.635; 9 -1.27,-0.635; 10 -2.54,-0.635 | drill 0.65 pad 1.067: 3 0,0.635; 4 1.27,0.635; 5 2.54,0.635; 6 2.54,-0.635; 7 1.27,-0.635; 8 0,-0.635
SOT95P275X110-5N = smd 1.42 x 0.58: 1 -1.145,0.95; 2 -1.145,0; 3 -1.145,-0.95; 4 1.145,-0.95; 5 1.145,0.95
QFN50P300X300X60-21N = smd 0.62 x 0.26: 1 -1.555,1; 2 -1.555,0.5; 3 -1.555,0; 4 -1.555,-0.5; 5 -1.555,-1; 11 1.555,-1; 12 1.555,-0.5; 13 1.555,0; 14 1.555,0.5; 15 1.555,1 | smd 0.26 x 0.62: 6 -1,-1.555; 7 -0.5,-1.555; 8 0,-1.555; 9 0.5,-1.555; 10 1,-1.555; 16 1,1.555; 17 0.5,1.555; 18 0,1.555; 19 -0.5,1.555; 20 -1,1.555
QFN28_5X5_05P_NO_VIAS = smd 0.9 x 0.3: 1 -2.3,1.5; 2 -2.3,1; 3 -2.3,0.5; 4 -2.3,0; 5 -2.3,-0.5; 6 -2.3,-1; 7 -2.3,-1.5; 15 2.3,-1.5; 16 2.3,-1; 17 2.3,-0.5; 18 2.3,0; 19 2.3,0.5; 20 2.3,1; 21 2.3,1.5 | smd 0.3 x 0.9: 8 -1.5,-2.3; 9 -1,-2.3; 10 -0.5,-2.3; 11 0,-2.3; 12 0.5,-2.3; 13 1,-2.3; 14 1.5,-2.3; 22 1.5,2.3; 23 1,2.3; 24 0.5,2.3; 25 0,2.3; 26 -0.5,2.3; 27 -1,2.3; 28 -1.5,2.3 | smd 3.25 x 3.25: GND 0,0
SOP65P490X110-8N = smd 1.499 x 0.432: 1 -2.184,0.965; 2 -2.184,0.33; 3 -2.184,-0.33; 4 -2.184,-0.965; 5 2.184,-0.965; 6 2.184,-0.33; 7 2.184,0.33; 8 2.184,0.965
636101111001 = smd 1 x 1.05: 1 0,-1.525 | smd 1.05 x 2.2: 2 1.475,0; 3 -1.475,0
INDC1006X60N = smd 0.51 x 0.73: 1 -0.46,0; 2 0.46,0
_0402 = smd 0.6 x 0.6: 1 -0.508,0; 2 0.508,0
IND_LPS4012-103MRB = smd 0.87 x 1.15: 1 -1.765,0; 2 1.765,0
INDC1608X95N = smd 0.9 x 0.97: 1 -0.785,0; 2 0.785,0
CHIPLED_0805 = smd 1.2 x 1.2: A 0,-1.05; C 0,1.05
IC_MIC94081YFT-TR = smd 0.2 x 0.2: 1 -0.2,0.2; 2 -0.2,-0.2; 3 0.2,-0.2; 4 0.2,0.2
SMT-JUMPER_2_NO_SILK = smd 0.635 x 1.27: 1 -0.406,0; 2 0.406,0
SOT95P240X111-3N = smd 1.23 x 0.6: 1 -1.06,0.95; 2 -1.06,-0.95; 3 1.06,0
SOT23-3 = smd 0.8 x 0.9: 1 -0.95,-1; 2 0.95,-1; 3 0,1.1
RESCAXS50P200X100X45-8N = smd 0.69 x 0.44: 1 -0.67,0.8; 4 -0.67,-0.8; 5 0.67,-0.8; 8 0.67,0.8 | smd 0.69 x 0.34: 2 -0.67,0.25; 3 -0.67,-0.25; 6 0.67,-0.25; 7 0.67,0.25
0603 = smd 1.1 x 1: 1 -0.85,0; 2 0.85,0
SJ_3 = smd 0.635 x 1.27: 1 -0.889,0; 2 0,0; 3 0.889,0
1X03_ROUND = drill 1 pad 1.676: 1 -2.54,0; 2 0,0; 3 2.54,0
R0805 = smd 1.3 x 1.5: 1 -0.95,0; 2 0.95,0

### Placement (x,y rotation side)
AUX  43.5,18.41 90 top
BOOST  29.69,11.43 0 top
BUCK  28.89,11.43 0 top
C1  6.67,14.73 180 top
C2  9.68,14.73 180 top
C3  8.26,12.98 270 top
C4  9.68,13.46 180 top
C7  11.43,21.11 0 top
C8  17.14,20.32 90 top
C9  19.68,20.32 90 top
C10  22.23,20.32 90 top
C11  28.73,20.64 90 top
C12  29.05,17.78 180 top
C13  33.42,11.51 0 top
C15  7.62,20 270 top
C16  26.91,3.24 0 top
CBOOST  17.2,8.38 270 top
CBUCK  19.53,6.83 0 top
CFG0  10.79,2.22 90 top
CFG1  8.73,2.22 90 top
CFG2  6.67,2.22 90 top
CHV  23.34,16.35 90 top
CLV  24.77,16.35 90 top
CSRC  9.68,9.21 180 top
D2  14.61,20.48 0 top
DEBUG  37.95,22.58 180 top
DISCHARGE  35.34,2.42 0 top
ENVH  16.99,2.22 90 top
ENVL  19.05,2.22 90 top
IC1  26.19,21.11 270 top
IC2  30.64,14.76 270 top
IC3  19.37,13.18 90 top
IC4  5.04,20.11 90 top
J1  2.66,14.1 90 top
L1  8.26,15.21 270 top
L2  12.7,14.73 0 top
L3  6.67,13.46 0 top
L4  12.7,13.46 0 top
L5  9.05,19.84 90 top
LBOOST  13.71,7.69 180 top
LBUCK  19.53,8.41 0 top
LED1  1.31,2.42 0 top
LS4  41.42,13.16 90 top
MPP0  14.92,2.22 90 top
MPP1  12.86,2.22 90 top
NC  9.84,7.14 0 top
Q1  26.11,9.91 90 bottom
Q2  29.19,9.91 90 bottom
Q3  32.27,9.91 90 bottom
Q4  35.34,9.91 90 bottom
Q5  38.42,9.91 90 bottom
Q6  41.66,9.91 90 bottom
Q7  37.47,12.86 0 top
R1  32.7,5.4 270 bottom
R3  36.99,18.73 0 top
R9  18.41,20.32 90 top
R10  20.95,20.32 270 top
R11  23.5,20.32 270 top
R12  3.16,2.13 90 top
R13  35.56,5.4 270 bottom
R14  30.96,9.68 90 top
R15  38.26,9.68 90 top
SJ1  32.52,19.25 0 top
SJ2  11.43,19.21 180 top
STONB  21.11,2.22 90 top
UART  43.5,4.6 90 top
Z1  14.61,14.73 0 top
Z2  11.11,14.1 90 top
Z3  14.61,13.46 0 top
ZMPPT1  7.14,7.94 90 top

### Tracks (layer width: path | path; a pad name or v marks a point on that pad's centre or on a via)
3.3V
  Top 0.203: SJ1.3 33.41,23.88 33.97,24.45 40.01,24.45 40.48,23.97 40.48,23.23 DEBUG.1
ANT
  Top 0.254: C1.2 6.24,15.35 6,15.59 IC4.4 6,19.02 6.35,19.37 7.61,19.37 C15.2 9.03,19.35 L5.1
  Top 0.61: L3.1 6.21,14.1 | 6.21,14.1 6.21,14.7 C1.2 | J1.1 6.21,14.1
BATT
  Top 0.203: R14.5 31.75,10.31 31.75,10.79 31.43,11.11 30.8,11.11 29.69,12.22 28.73,12.22 27.94,13.02 26.99,13.02 26.51,13.49
  Top 0.305: IC3.16 20.37,16.72 22.07,18.41 25.88,18.41 26.51,17.78 26.51,13.49 26.51,5.87 27.62,4.76 28.57,4.76 29.11,4.22 C16.1
  Top 0.406: STONB.1 28.4,1.41 29.11,2.12 C16.1
BOOST  (1 unrouted)
  Top 0.152: BOOST.TP 30,11.11 30.32,11.11 30.71,10.73 R14.7
  Top 0.254: IC3.1 17.87,10.41 17.14,9.68 17.14,9.21 CBOOST.1
BUCK  (1 unrouted)
  Top 0.152: R14.8 29.81,10.35 29.21,10.95 29.05,10.95 28.89,11.11 BUCK.TP
  Top 0.203: IC3.3 18.87,9.71 19.53,9.05 19.53,8.73 19.68,8.57 LBUCK.2 20.31,7.06 CBUCK.2 20.32,6.74 20.32,6.19 20.16,6.03 18.26,6.03 17.94,5.71 17.94,1.41
  Top 0.406: CFG2.1 CFG1.1 CFG0.1 MPP1.1 MPP0.1 ENVH.1 17.94,1.41 ENVL.1
BUFSRC
  Top 0.203: IC3.27 16.46,12.18 15.88,11.59 | R15.7 38.01,9.93 38.26,9.68 39.37,9.68 39.69,9.37 39.69,8.73 39.85,8.57 40.16,8.57 40.64,8.1 40.64,7.62 40.32,7.3 40.32,0.95 39.85,0.48 6.03,0.48 5.71,0.79 5.71,4.76 6.03,5.08 7.94,5.08 8.1,4.92 10,4.92 10.48,5.4 10.48,6.19 10.25,6.42 NC.2
  Top 0.406: NC.2 10.2,7.2 10.2,8.97 CSRC.1
  pour Top: 10,6.67 10,10 10.32,10.32 14.61,10.32 16.19,11.91 16.19,11.43 14.76,10 13.97,10 13.34,9.37 13.34,5.71 13.02,5.4 11.27,5.4
CFG0  (via drill 0.31)
  Top 0.203: IC3.6 20.37,10.27 20.48,10.16 21.75,10.16 22.38,9.53 22.38,8.89 22.54,8.73 22.54,7.94 v22.38,7.78 | CFG0.2 v10.95,2.22
  Bottom 0.203: v22.38,7.78 22.38,7.14 19.05,3.81 11.27,3.81 10.95,3.49 v10.95,2.22
CFG1  (via drill 0.31)
  Top 0.152: CFG1.2 8.22,2.2
  Top 0.203: CFG1.2 v8.89,2.22 | IC3.5 19.87,9.98 20.16,9.68 21.59,9.68 21.91,9.37 v21.91,8.41
  Bottom 0.203: v8.89,2.22 8.89,3.81 9.37,4.29 18.89,4.29 21.75,7.14 21.75,8.26 v21.91,8.41
CFG2  (via drill 0.31)
  Top 0.152: CFG2.2 6.65,2.17
  Top 0.203: IC3.4 19.37,9.84 20,9.21 21.11,9.21 v21.27,9.05 | CFG2.2 v6.83,2.22
  Bottom 0.203: v6.83,2.22 6.83,3.97 7.62,4.76 18.73,4.76 21.27,7.3 v21.27,9.05
D1  (via drill 0.31)
  Top 0.254: v28.42,10 28.42,9.37 28.73,9.05 30.14,9.05 R14.1
  Bottom 0.254: Q1.3 26.11,10.09 26.35,9.84 27.62,9.84 27.78,10 v28.42,10
D2  (via drill 0.31)
  Top 0.254: v29.21,8.41 29.37,8.26 30.48,8.26 30.71,8.48 R14.2
  Bottom 0.254: Q2.3 29.19,8.44 v29.21,8.41
D3  (via drill 0.31)
  Top 0.152: R14.3 31.21,9.46 31.43,9.68 32.23,9.68 32.54,10 v32.54,10.48
  Bottom 0.203: v32.54,10.48 32.38,10.86 Q3.3
D4  (via drill 0.31)
  Top 0.203: R14.4 31.77,9.05 35.08,9.05 35.4,9.37 v35.4,10.95
  Bottom 0.203: v35.4,10.95 35.34,11.01 Q4.3
D5  (via drill 0.31)
  Top 0.203: R15.1 37.47,8.95 37.47,7.94 v37.31,7.78
  Bottom 0.203: Q5.3 37.49,10.97 36.99,10.48 36.99,9.6 36.91,9.53 36.91,8.02 37.15,7.78 v37.31,7.78
D6  (via drill 0.31)
  Top 0.203: v40.01,7.94 38.26,7.94 38.01,8.19 R15.2
  Bottom 0.203: Q6.3 41.66,10.38 41.27,10 40.48,10 40.01,9.53 v40.01,7.94
ENHV  (via drill 0.31)
  Top 0.203: ENVH.2 v17.14,2.22 | v23.02,13.18 23.02,13.34 22.68,13.68 IC3.12
  Bottom 0.203: v17.14,2.22 17.3,2.38 19.53,2.38 23.81,6.67 23.81,7.14 24.13,7.46 24.13,11.27 23.18,12.22 23.18,13.02 v23.02,13.18
ENLV  (via drill 0.31)
  Top 0.203: ENVL.2 19.84,2.22 v20,2.06 | v24.45,6.67 24.45,10.32 23.81,10.95 v23.5,10.95 | v19.53,16.35 19.37,16.19 IC3.18
  Bottom 0.203: v20,2.06 20,2.22 v24.45,6.67 | v23.5,10.95 23.5,11.27 22.86,11.91 22.7,11.91 22.38,12.22 22.38,13.81 20.95,15.24 20.95,16.19 20.64,16.51 19.68,16.51 v19.53,16.35
G1
  Bottom 0.254: Q1.1 27.06,7.87 28.1,6.83 31.59,6.83 31.91,6.51 31.91,6.02 R1.1 31.58,6.02 31.27,5.71 31.27,3.33 31.56,3.05 DISCHARGE.1
G2  (via drill 0.31)
  Top 0.254: DISCHARGE.2 34.07,3.71 33.18,4.6 33.02,4.6 32.54,5.08 32.54,7.3 v32.38,7.46
  Bottom 0.254: R1.2 32.45,6.6 31.75,7.3 | 31.75,7.3 30.64,7.3 30.14,7.8 Q2.1 | v32.38,7.46 31.91,7.46 31.75,7.3
G3  (via drill 0.31)
  Top 0.254: DISCHARGE.3 35.34,3.07 33.02,5.4 33.02,7.42 v33.22,7.62
  Bottom 0.254: Q3.1 33.22,7.78 v33.22,7.62 33.22,7.02 32.95,6.76 R1.3
G4
  Bottom 0.254: Q4.1 36.29,8.04 36.04,7.78 34.13,7.78 33.81,7.46 33.81,6.83 33.5,6.51 R1.4 33.52,6.03 33.97,6.03 34.13,5.87 34.13,4.13 34.29,3.97 35.88,3.97 36.61,3.23 DISCHARGE.4
G5  (via drill 0.31)
  Top 0.254: DISCHARGE.5 37.88,3.23 36.2,4.92 35.24,4.92 34.77,5.4 34.77,6.99 v34.61,7.14
  Bottom 0.254: R13.1 34.76,6.82 34.92,6.99 | 34.92,6.99 35.24,7.3 36.83,7.3 37.15,6.99 38.58,6.99 39.37,7.78 Q5.1 | v34.61,7.14 34.77,7.14 34.92,6.99
G6
  Bottom 0.254: R13.2 35.31,6.58 35.56,6.83 36.67,6.83 36.99,6.51 38.89,6.51 | Q6.1 42.61,8.16 41.27,6.83 39.21,6.83 38.89,6.51 | DISCHARGE.6 38.45,1.78 38.89,2.22 38.89,6.51
GND  (via drill 0.31)
  Top 0.203: LS4.2 41.62,12.51 41.78,12.35 v42.23,12.35 | CBUCK.1 17.97,6.83 v17.78,6.63
  Top 0.254: IC3.10 19.87,12.68 IC3.GND | IC3.17 19.87,14.58 v20.32,14.13
  Top 0.305: IC3.GND 17.87,14.68 IC3.22 16.76,14.68 16.51,14.92 16.51,15.37
  Top 0.406: IC4.3 5.37,16.93 v4.92,16.48
  Bottom 0.203: R1.7 32.45,4 32.26,3.81 31.91,3.81 v31.91,3.78
  other vias: 7.14,16.16 8.1,16.8 9.37,16.16 10.32,16.16 11.27,16.16 12.22,16.16 13.18,16.16 14.13,16.16 15.08,16.16 16.03,15.84 5.87,12.03 6.99,12.03 8.1,11.4 9.37,12.03 10.32,12.03 11.27,12.03 12.22,12.03 10,11.08 11.59,11.08 11.75,17.43 15.4,17.43 5.4,19.49 18.73,18.7 20.32,13.18 20.32,12.22 22.54,2.83 16.99,6.48 6.35,5.68 4.6,1.24 26.83,2.19 22.38,17.75 25.88,17.11 29.53,7.43 30.16,15.24 31.11,15.24 30.16,14.29 31.11,14.29 24.61,21.08 26.19,22.67 28.73,16.48 25.24,7.75 35.72,17.11 37.31,5.05 39.37,1.24 31.43,1.24 32.38,8.38 34.29,10.6 6.35,4.41 29.69,22.83 30.16,19.34 27.94,18.86 27.3,10.45 28.1,11.71 39.37,13.94
  pour Top (isolate 0.6, rank 6): -3.33,27.27 45,27.22 45,-3.02 -3.33,-3.05
  pour Bottom (isolate 0.6): 4.6,11.4 4.6,17.11 5.24,17.75 16.67,17.75 18.57,15.84 18.57,11.4 17.94,10.76 5.24,10.76
  pour Top (rank 5): -10,33.5 61.59,33.5 61.59,-14.13 -5.4,-14.13 -5.4,10.32 16.99,10.32 16.99,16.83 -10,16.83
  pour Bottom: -12.38,18.89 16.99,18.89 19.53,16.35 19.53,10.64 18.73,9.84 -11.43,9.84 -11.43,-3.49 51.44,-3.49 51.44,27.78 -12.38,27.78
HVOUT  (via drill 0.31)
  Top 0.203: 23.34,15.08 23.5,15.08 23.97,14.61 23.97,13.81 v24.61,13.18 | v37.47,11.91 37.47,10.3 R15.8
  Top 0.254: IC3.14 22.93,14.68 23.34,15.08 CHV.1
  Bottom 0.203: v24.61,13.18 25.08,13.18 25.4,13.49 26.51,13.49 26.99,13.02 28.26,13.02 28.73,13.49 29.37,13.49 29.84,13.02 29.84,12.06 30.48,11.43 31.43,11.43 31.91,11.91 32.7,11.91 32.86,11.75 33.97,11.75 34.13,11.91 v37.47,11.91
LED  (via drill 0.31)
  Top 0.203: R12.2 4.79,2.98 v5.08,2.7 | v29.05,12.86 29.37,12.86 29.64,13.13 IC2.11
  Bottom 0.203: 5.08,2.54 6.03,1.59 19.53,1.59 19.68,1.43 20.32,1.43 20.48,1.59 22.38,1.59 23.18,2.38 23.18,4.13 24.61,5.56 24.77,5.56 25.88,6.67 25.88,9.68 25.4,10.16 25.4,11.75 25.24,11.91 25.24,12.54 25.72,13.02 26.35,13.02 26.83,12.54 28.42,12.54 28.73,12.86 v29.05,12.86
  Bottom 0.254: v5.08,2.7 5.08,2.54
LVOUT  (via drill 0.31)
  Top 0.152: R14.6 31.21,9.93 30.96,9.68 29.21,9.68 29.05,9.84 29.05,10.48 28.89,10.64 28.1,10.64 27.46,11.27 v27.15,11.27
  Top 0.203: IC3.11 22.23,13.18 22.38,13.02 22.38,12.7 22.54,12.54 24.77,12.54 25.24,13.02 | 25.24,13.02 25.24,13.34 24.77,13.81 CLV.1 | 25.24,13.02 25.56,12.7 25.56,12.38 v25.88,12.06
  Top 0.254: SJ1.1 31.63,18.3 v31.43,18.1 | CLV.1 25.64,15.64 v25.72,15.72
  Bottom 0.152: v25.88,12.06 26.67,12.06 27.15,11.59 v27.15,11.27
  Bottom 0.254: v31.43,18.1 31.43,17.78 31.27,17.62 27.62,17.62 v25.72,15.72
N$1
  Top 0.203: IC2.14 31.14,12.84 31.75,12.22 33.5,12.22 34.13,12.86 38.1,12.86 38.42,12.54 Q7.2
N$3
  Top 0.61: L2.1 11.11,14.73 | 11.11,14.73 C2.1 | Z2.2 11.11,14.73
N$4
  Top 0.203: IC3.2 18.37,9.41 18.73,9.05 18.73,8.58 LBUCK.1
N$5
  Top 0.61: L4.1 11.11,13.46 | 11.11,13.46 C4.1 | Z2.1 11.11,13.46
N$6
  Top 0.61: Z1.1 L2.2
N$7
  Top 0.61: Z3.1 L4.2
N$8  (via drill 0.31)
  Top 0.203: IC3.26 16.33,12.68 14.92,11.27 v14.45,11.27 | NC.1 9.44,6.12 v9.84,5.71
  Bottom 0.203: v14.45,11.27 14.45,10.32 v9.84,5.71
N$15
  Top 0.203: R10.2 C10.1 R11.2 24.43,19.67 24.77,20 25.21,20 IC1.4
N$17
  Top 0.254: C9.1 R9.1 C8.1 16.5,19.67 16.2,19.38 D2.2
N$18
  Top 0.254: C7.2 12.7,21.11 13.18,21.59 14.59,21.59 D2.3
N$20
  Top 0.203: LED1.A 2.44,1.36 2.54,1.27 3.14,1.27 R12.1
NRST
  Top 0.203: IC2.3 30.64,16.67 30.96,16.99 32.23,16.99 33.5,18.26 34.92,18.26 35.4,18.73 35.4,21.93 DEBUG.10
PB9  (via drill 0.31)
  Top 0.203: IC2.20 33.23,15.76 33.5,16.03 36.35,16.03 v36.51,15.88 | v38.73,17.78 38.73,18.41 38.42,18.73 R3.2
  Bottom 0.203: v36.51,15.88 37.31,15.88 38.73,17.3 v38.73,17.78
REDRM
  Top 0.305: Z3.2 15.72,13.46 15.93,13.68 IC3.24
REDRP
  Top 0.305: Z1.2 15.56,14.73 16.11,14.18 IC3.23
RX
  Top 0.203: IC2.6 28.53,15.76 28.26,16.03 27.62,16.03 27.3,16.35 27.3,18.1 26.35,19.05 26.35,20.8 27.15,21.59 IC1.1
RX_BITLINE
  Top 0.254: R9.2 C9.2 R10.1 20.95,21.91 21.27,22.23 25.21,22.23 IC1.3
RX_EN
  Top 0.203: IC1.5 28.71,19.97 C11.1 28.73,19.21 29.05,18.89 29.05,17.14 29.64,16.56 IC2.5
S1  (1 unrouted)
  Top 0.61: C2.2 8.26,14.73 | 8.26,14.73 C1.1 | L1.2 8.26,14.73
S2  (1 unrouted)
  Top 0.61: C4.2 8.26,13.46 | 8.26,13.46 L3.2 | C3.1 8.26,13.46
SCL  (via drill 0.31)
  Top 0.203: IC2.7 28.39,15.26 28.1,15.56 v27.3,15.56 | v38.58,19.84 38.89,20.16 41.27,20.16 42.07,20.95 AUX.4
  Bottom 0.203: v27.3,15.56 27.3,16.19 28.26,17.14 33.34,17.14 33.5,16.99 33.97,16.99 34.77,17.78 35.88,17.78 36.99,16.67 37.47,16.67 38.1,17.3 38.1,18.1 38.58,18.57 v38.58,19.84
SDA  (via drill 0.31)
  Top 0.203: IC2.15 31.88,13.21 32.23,12.86 v33.18,12.86
  Bottom 0.203: v33.18,12.86 36.2,12.86 40.32,16.99 40.32,18.1 40.64,18.41 AUX.3
SELMPP0  (via drill 0.31)
  Top 0.203: MPP0.2 v15.08,2.22 | IC3.8 22.14,11.68 v22.54,11.27
  Bottom 0.203: v15.08,2.22 15.08,2.7 15.24,2.86 19.37,2.86 23.34,6.83 23.34,7.3 23.65,7.62 23.65,9.68 22.54,10.79 v22.54,11.27
SELMPP1  (via drill 0.31)
  Top 0.203: MPP1.2 v13.02,2.22 | v23.02,9.37 23.02,9.53 21.91,10.64 21.59,10.64 21.35,10.88 IC3.7
  Bottom 0.203: v13.02,2.22 13.02,3.02 13.34,3.33 19.21,3.33 22.86,6.99 22.86,7.46 23.18,7.78 23.18,9.21 v23.02,9.37
SIGNAL
  Top 0.254: L5.2 9.56,20.35 10,20.8 10,20.95 10.16,21.11 C7.1 10.79,21.1 10.79,20.32 10.95,20.16 11.27,20.16 11.43,20 SJ2.2
STAT0  (via drill 0.31)
  Top 0.254: IC3.21 17.87,16.26 v17.46,16.67 | v27.78,14.92 28.1,14.92 28.26,14.76 IC2.8
  Bottom 0.254: v17.46,16.67 17.46,17.3 18.26,18.1 21.11,18.1 22.38,16.83 22.38,15.72 23.18,14.92 v27.78,14.92
STAT1  (via drill 0.31)
  Top 0.254: IC3.20 18.37,16.72 v18.26,16.83 | v27.3,14.29 28.42,14.29 28.44,14.26 IC2.9
  Bottom 0.254: v18.26,16.83 18.26,17.3 18.57,17.62 20.95,17.62 21.91,16.67 21.91,15.56 23.02,14.45 26.83,14.45 26.99,14.29 v27.3,14.29
STAT2  (via drill 0.31)
  Top 0.254: IC3.19 18.87,16.8 v19.05,16.99 | IC2.10 28.05,13.76 v27.94,13.65
  Bottom 0.254: v19.05,16.99 20.8,16.99 21.43,16.35 21.43,15.4 22.86,13.97 26.67,13.97 26.99,13.65 v27.94,13.65
STONBAT  (via drill 0.31)
  Top 0.203: IC3.13 22.97,14.18 23.81,13.34 v23.81,13.18 | STONB.2 v21.27,2.22
  Bottom 0.203: v23.81,13.18 23.81,12.22 24.61,11.43 24.61,7.46 25.08,6.99 25.08,6.51 24.61,6.03 24.45,6.03 21.27,2.86 v21.27,2.22
SWBOOST
  Top 0.2: IC3.28 17.07,11.73
  pour Top (rank 3): 16.67,11.75 16.67,11.27 14.92,9.53 13.81,9.53 13.81,5.71 14.13,5.4 16.03,5.4 16.35,5.71 16.35,10.32 17.46,11.43 17.46,11.75
SWDCLK  (via drill 0.31)
  Top 0.203: IC2.17 33,14.26 v33.02,14.13
  Bottom 0.203: v33.02,14.13 33.97,14.13 34.29,13.81 35.88,13.81 39.37,17.3 39.37,21.78 DEBUG.4
SWDIO  (via drill 0.31)
  Top 0.203: v33.66,13.49 32.46,13.49 IC2.16
  Bottom 0.203: v33.66,13.49 33.81,13.34 36.04,13.34 39.85,17.14 39.85,20.95 40.16,21.27 40.32,21.27 40.48,21.43 40.48,21.93 DEBUG.2
TX  (via drill 0.31)
  Top 0.203: IC4.2 4.71,19.26 3.81,20.16 2.86,20.16 2.54,20.48 2.54,23.34 3.02,23.81 31.75,23.81 32.23,23.34 32.23,22.23 v32.07,22.07 | v33.81,17.62 34.45,17.62 v34.92,17.14 | Q7.3 35.25,13.96 v34.77,14.45
  Bottom 0.203: v32.07,22.07 32.07,21.27 32.38,20.95 33.18,20.95 33.5,20.64 33.5,17.94 v33.81,17.62 | v34.92,17.14 34.92,14.61 v34.77,14.45
USART2_RX
  Top 0.203: UART.1 42.7,2.06 42.39,2.38 42.39,10 40.48,11.91 40.48,14.61 39.69,15.4 37.15,15.4 36.99,15.24 36.04,15.24 35.72,15.56 33.81,15.56 33.52,15.26 IC2.19
USART2_TX  (via drill 0.31)
  Top 0.203: IC2.18 33.66,14.76 33.97,15.08 35.56,15.08 35.88,14.76 37.31,14.76 37.47,14.92 39.53,14.92 40.01,14.45 40.01,11.75 41.91,9.84 41.91,4.92 v41.75,4.76 | Q7.1 36.52,7.78 37.15,7.14 39.37,7.14 39.69,6.83 v39.69,6.19
  Bottom 0.203: UART.2 41.91,4.6 v41.75,4.76 40.32,6.19 v39.69,6.19
VDD  (via drill 0.31)
  Top 0.203: SJ1.2 32.52,17.91 32.07,17.46 30.8,17.46 30.48,17.78 C12.1 29.7,17.13 30.14,16.69 IC2.4 | v37.15,17.3 38.1,16.35 40.48,16.35 v40.64,16.19 41.75,15.08 41.75,13.97 41.62,13.84 LS4.3
  Top 0.254: IC4.1 4.07,19.26 3.65,19.68 2.54,19.68 2.06,20.16 2.06,23.5 2.86,24.29 31.91,24.29 32.7,23.5 v32.7,21.59 32.17,21.06 32.52,20.71 SJ1.2 | IC2.13 v30.64,12.06 31.19,11.51 C13.1
  Bottom 0.203: v37.15,17.3 36.2,18.26 34.29,18.26 33.97,18.57 33.97,21.27 33.66,21.59 v32.7,21.59 | v30.64,12.06 31.43,12.06 31.75,12.38 32.86,12.38 33.02,12.22 33.5,12.22 33.66,12.38 36.35,12.38 40.16,16.19 v40.64,16.19
VDD-AUX
  Top 0.203: LS4.1 41.22,11.96 41.43,11.75 43.18,11.75 43.5,12.06 AUX.1
VDD-AUX-EN  (via drill 0.31)
  Top 0.203: IC2.1 31.88,16.32 32.07,16.51 36.99,16.51 37.62,15.88 39.85,15.88 40.88,14.84 | LS4.4 41.22,14.5 40.88,14.84 | v40.96,14.92 40.88,14.84
  Bottom 0.203: AUX.2 41.91,15.88 v40.96,14.92
ZMPP  (via drill 0.31)
  Top 0.203: IC3.25 16.19,13.18 15.24,12.22 14.29,12.22 v13.18,11.11 | v8.41,5.56 7.46,5.56 7.14,5.87 ZMPPT1.1
  Bottom 0.203: v13.18,11.11 13.18,10.32 v8.41,5.56

### Text on the board
tPlace: Chesney Buyle | v1.1 | GND | PA4 | 3V3 | LVOUT | PA10 | PC14 | VCC | Energy Neutral Device | GND | TX | RX
tNames: Jarne Van Mulders